# Altium project PCB_Project.PrjPcb
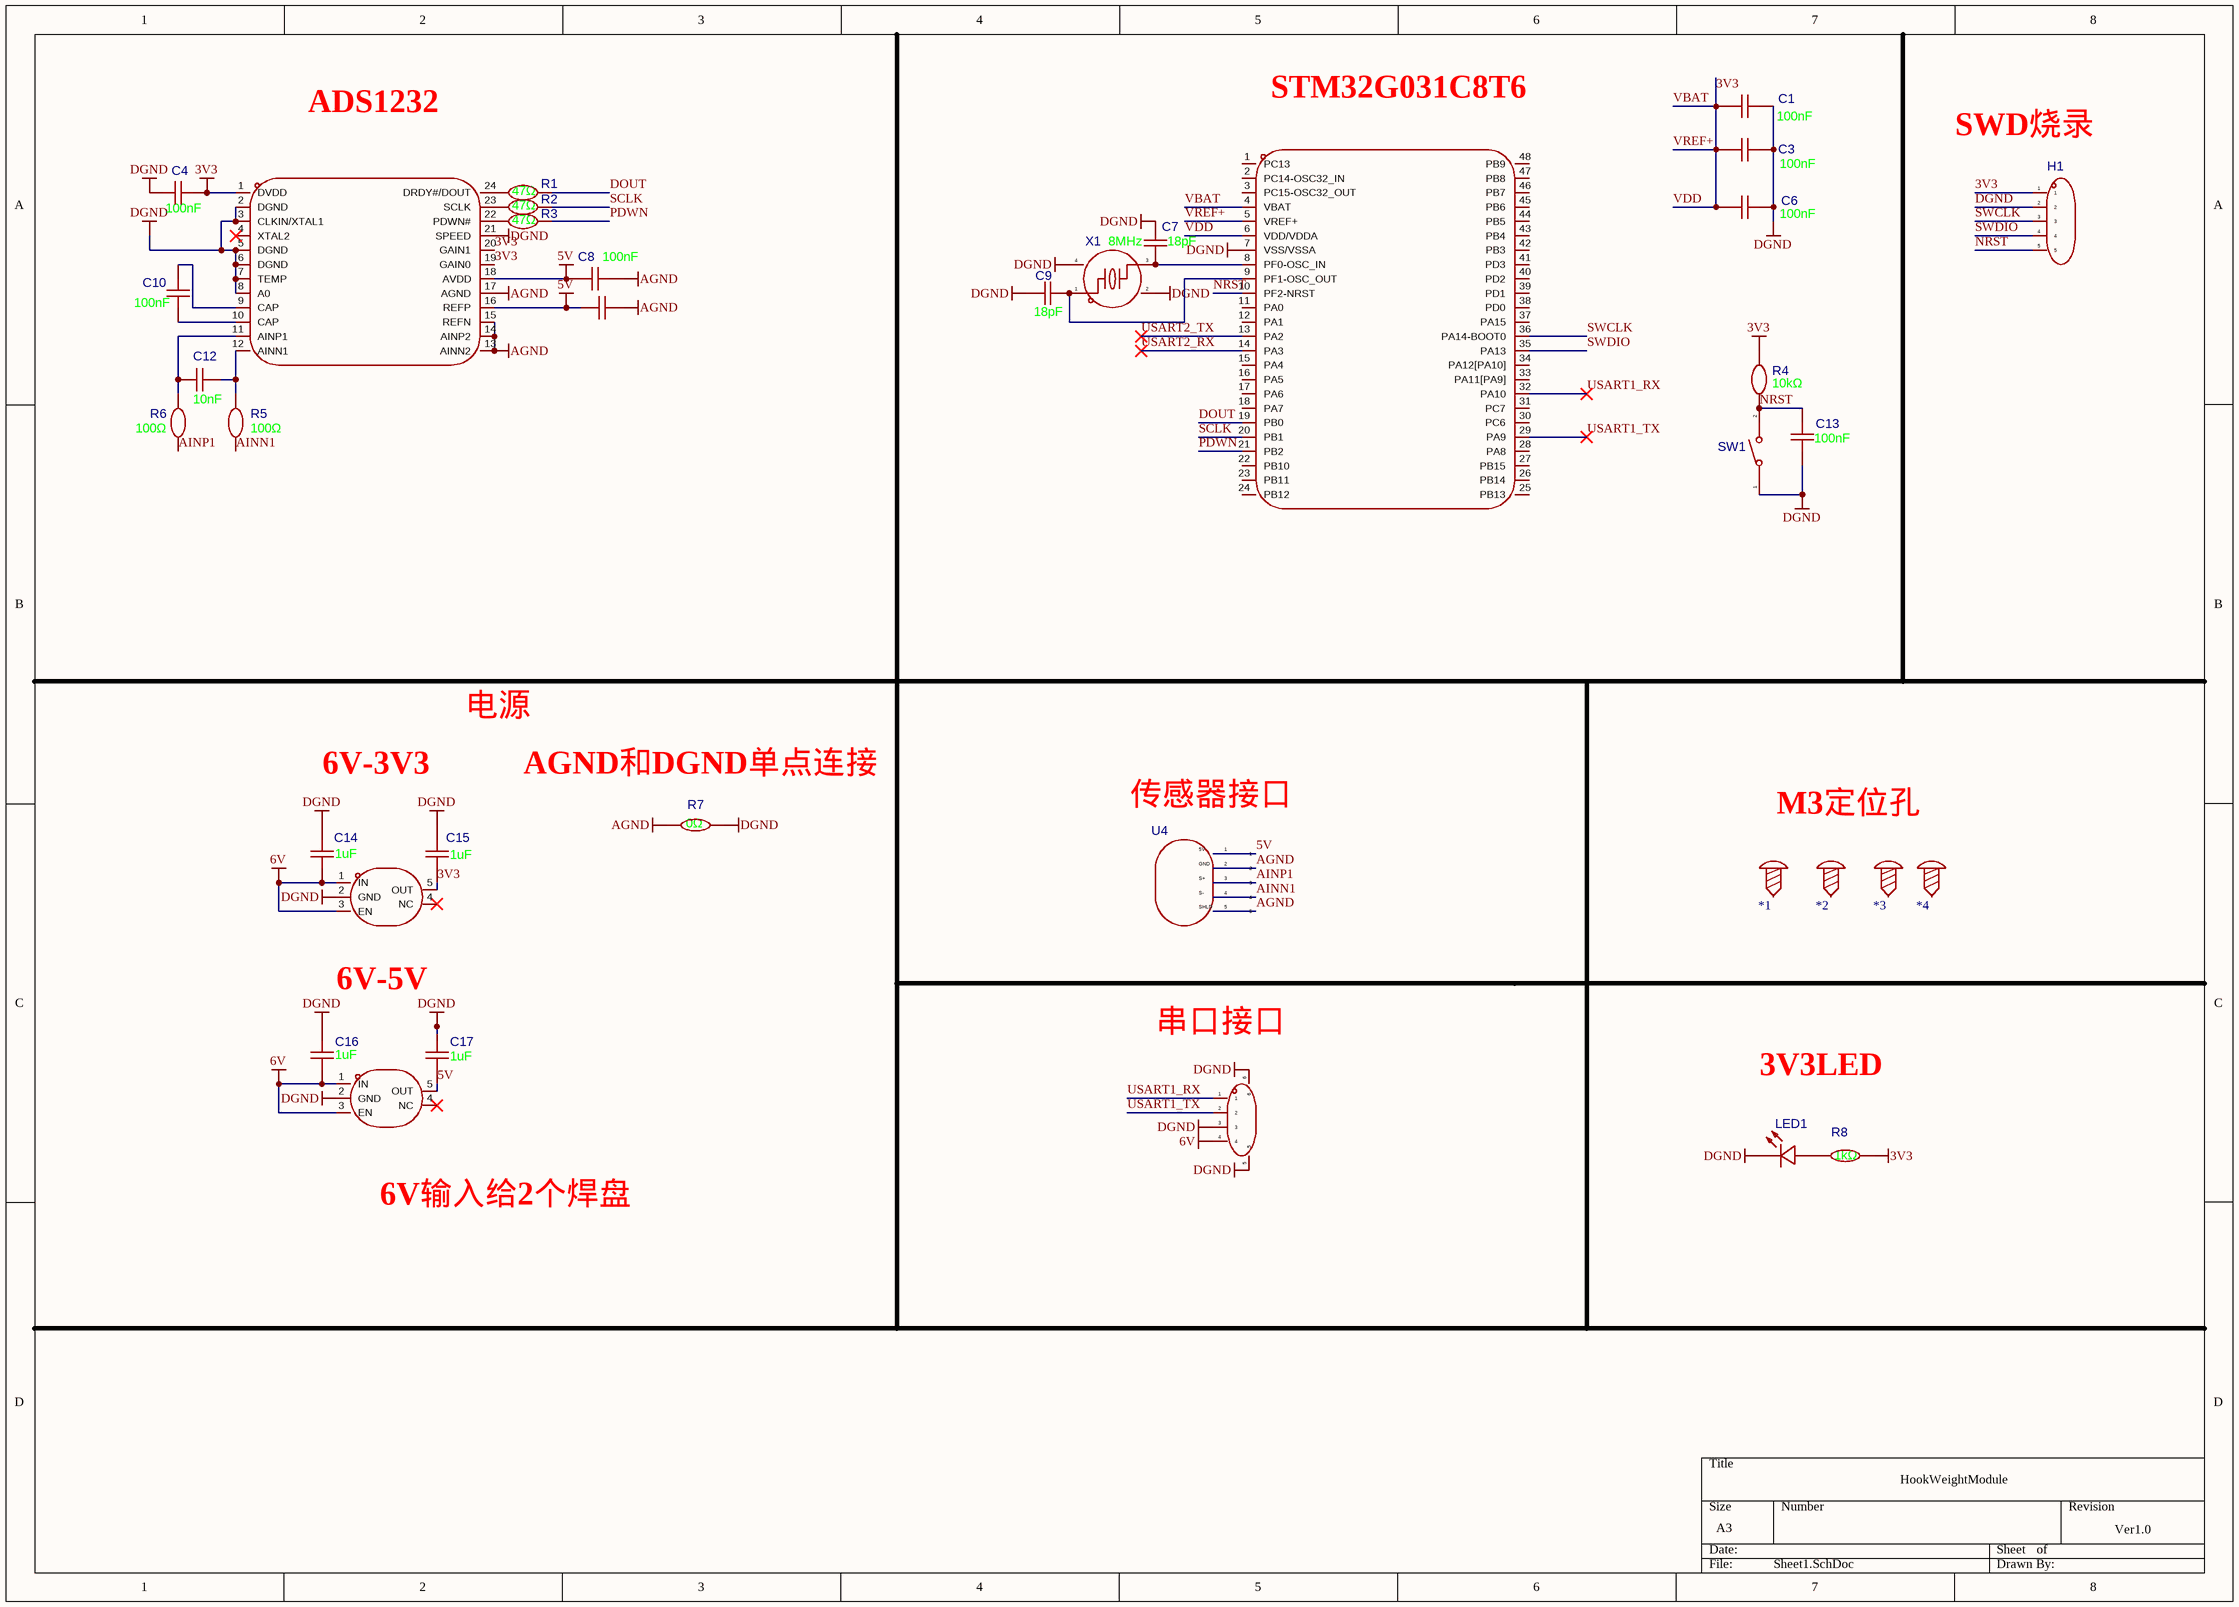
[diagram p0: Sheet1.SchDoc]
1 sheet, 37 parts. Net scope: global (net labels, ports and power ports of the same name join across sheets).
Board file: PCB1.PcbDoc

## Sheet Sheet1.SchDoc
size A3; SheetNumber: 1; SheetTotal: 1

### Parts
*1  螺丝孔_1  [M3螺丝]  (value not drawn)
*2  螺丝孔_1  [M3螺丝]  (value not drawn)
*3  螺丝孔_1  [M3螺丝]  (value not drawn)
*4  螺丝孔_1  [M3螺丝]  (value not drawn)
C1  value 100nF  [C0402]  (hidden comment: cc0402krx7r7bb104)
C3  value 100nF  [C0402]  (hidden comment: cc0402krx7r7bb104)
C4  value 100nF  [C0402]  (hidden comment: cc0402krx7r7bb104)
C6  value 100nF  [C0402]  (hidden comment: cc0402krx7r7bb104)
C7  value 18pF  [C0402]  (hidden comment: cc0402jrnpo9bn180)
C8  value 100nF  [C0402]  (hidden comment: cc0402krx7r7bb104)
C9  value 18pF  [C0402]  (hidden comment: cc0402jrnpo9bn180)
C10  value 100nF  [C0402]  (hidden comment: cc0402krx7r7bb104)
C11  cl21b103kbannnc  [C0805]  (value not drawn)
C12  value 10nF  [C0805]  (hidden comment: cl21b103kbannnc)
C13  value 100nF  [C0402]  (hidden comment: cc0402krx7r7bb104)
C14  value 1uF  [C0603]  (hidden comment: cga0603x5r105k500jt)
C15  value 1uF  [C0603]  (hidden comment: cga0603x5r105k500jt)
C16  value 1uF  [C0603]  (hidden comment: cga0603x5r105k500jt)
C17  value 1uF  [C0603]  (hidden comment: cga0603x5r105k500jt)
H1  pz254v-11-05p  [HDR-TH_5P-P2.54-V-M]  (value not drawn)
LED1  ltst-c190kskt  [LED0603-RD]  (value not drawn)
R1  value 47Ω  [R0402]  (hidden comment: frc0402f47r0ts)
R2  value 47Ω  [R0402]  (hidden comment: frc0402f47r0ts)
R3  value 47Ω  [R0402]  (hidden comment: frc0402f47r0ts)
R4  value 10kΩ  [R0603]  (hidden comment: frc0603f1002ts)
R5  value 100Ω  [R0603]  (hidden comment: frc0603f1000ts)
R6  value 100Ω  [R0603]  (hidden comment: frc0603f1000ts)
R7  value 0Ω  [R0603]  (hidden comment: 0603waf0000t5e)
R8  value 1kΩ  [R0603]  (hidden comment: 0603waf1001t5e)
SW1  ts-1088-ar02016  [SW-SMD_L3.9-W3.0-P4.45]  (value not drawn)
U2  ads1232ipwr  [TSSOP-24_L7.8-W4.4-P0.65-LS6.4-BL]  (value not drawn)
U3  stm32g031c8t6  [LQFP-48_L7.0-W7.0-P0.50-LS9.0-BL]  (value not drawn)
U4  5个焊盘  [5个焊盘 - duplicate]  (value not drawn)
U5  tps7a2033pdbvr  [SOT-23-5_L2.9-W1.6-P0.95-LS2.8-BR]  (value not drawn)
U6  tps7a2050pdbvr  [SOT-23-5_L2.9-W1.6-P0.95-LS2.8-BR]  (value not drawn)
U7  bx-xh2.54-4pwt  [CONN-SMD_4P-P2.50_BX-XH2.54-4PWT]  (value not drawn)
X1  value 8MHz  [CRYSTAL-SMD_4P-L3.2-W2.5-BL]  (hidden comment: x32258mob4si)

### Nets
3V3: C1.1 C3.1 C4.2 C6.1 C15.1 H1.1 R4.2 R8.2 U2.1(DVDD) U2.19(GAIN0) U2.20(GAIN1) U3.4(VBAT) U3.5(VREF+) U3.6(VDD/VDDA) U5.5(OUT)  [also labelled VBAT, VDD, VREF+]
5V: C8.1 C11.1 C17.1 U2.16(REFP) U2.18(AVDD) U4.1 U6.5(OUT)
6V: C14.1 C16.1 U5.1(IN) U5.3(EN) U6.1(IN) U6.3(EN) U7.4
AGND: C8.2 C11.2 R7.1 U2.13(AINN2) U2.14(AINP2) U2.15(REFN) U2.17(AGND) U4.2 U4.5
DGND: C1.2 C3.2 C4.1 C6.2 C7.2 C9.1 C13.1 C14.2 C15.2 C16.2 C17.2 H1.2 LED1.1(-) R7.2 SW1.1 U2.2(DGND) U2.3(CLKIN/XTAL1) U2.5(DGND) U2.6(DGND) U2.7(TEMP) U2.8(A0) U2.21(SPEED) U3.7(VSS/VSSA) U5.2(GND) U6.2(GND) U7.3 U7.5 U7.6 X1.2(GND) X1.4(GND)
AINN1: R5.1 U4.4
AINP1: R6.1 U4.3
DOUT: R1.2 U3.19(PB0)
NRST: C13.2 H1.5 R4.1 SW1.2 U3.10(PF2-NRST)
PDWN: R3.2 U3.21(PB2)
SCLK: R2.2 U3.20(PB1)
SWCLK: H1.3 U3.36(PA14-BOOT0)
SWDIO: H1.4 U3.35(PA13)
USART1_RX: U3.32(PA10) U7.1
USART1_TX: U3.29(PA9) U7.2
USART2_RX: U3.14(PA3)
USART2_TX: U3.13(PA2)
NetC7_1: C7.1 U3.8(PF0-OSC_IN) X1.3
NetC9_2: C9.2 U3.9(PF1-OSC_OUT) X1.1
NetC10_1: C10.1 U2.10(CAP)
NetC10_2: C10.2 U2.9(CAP)
NetC12_1: C12.1 R6.2 U2.11(AINP1)
NetC12_2: C12.2 R5.2 U2.12(AINN1)
NetLED1_2: LED1.2(+) R8.1
NetR1_1: R1.1 U2.24(DRDY#/DOUT)
NetR2_1: R2.1 U2.23(SCLK)
NetR3_1: R3.1 U2.22(PDWN#)

Not connected (* = marked no-connect by the designer): *1 1; *2 1; *3 1; *4 1; U2 4(XTAL2)*; U3 1(PC13) 2(PC14-OSC32_IN) 3(PC15-OSC32_OUT) 11(PA0) 12(PA1) 15(PA4) 16(PA5) 17(PA6) 18(PA7) 22(PB10) 23(PB11) 24(PB12) 25(PB13) 26(PB14) 27(PB15) 28(PA8) 30(PC6) 31(PC7) 33(PA11[PA9]) 34(PA12[PA10]) 37(PA15) 38(PD0) 39(PD1) 40(PD2) 41(PD3) 42(PB3) 43(PB4) 44(PB5) 45(PB6) 46(PB7) 47(PB8) 48(PB9); U5 4(NC)*; U6 4(NC)*

### Notes on the sheet
- ADS1232
- STM32G031C8T6
- (near H1) SWD烧录
- 电源
- 6V-3V3
- (near R7) AGND和DGND单点连接
- (near U4) 传感器接口
- M3定位孔
- 6V-5V
- (near U7) 串口接口
- 3V3LED
- 6V输入给2个焊盘
- HookWeightModule
- Ver1.0
- (in symbol 5个焊盘) 5V; GND; S+; S-; SHLD

### Library data of the parts
C1 C3 C4 C6 C8 C10 C13 = cc0402krx7r7bb104: 容值:100nF;精度:±10%;额定电压:16V;温度系数:X7R;; Manufacturer: YAGEO(国巨); AddInBom: yes; ModelId: 36a51122f27c49738f86b3bfa98863e0; ModelName: C0402_L1.0-W0.5-H0.5; ModelTransform: 39.37,19.685,0,0,0,0,0,0,0; Tolerance: ±10%; Voltage Rating: 16V; Temperature Coefficient: X7R; Symbol: CC0402KRX7R7BB104; LCSC Part Name: 100nF ±10% 16V; SupplierPart: C60474; ManufacturerPart: CC0402KRX7R7BB104; Supplier Footprint: 0402; JLCPCB Part Class: Extended Part; Datasheet: https://item.szlcsc.com/datasheet/CC0402KRX7R7BB104/61526.html; Supplier: LCSC; ConvertToPcb: yes; FootprintName: C0402
C7 C9 = cc0402jrnpo9bn180: 容值:18pF;精度:±5%;额定电压:50V;温度系数:NP0;; Manufacturer: YAGEO(国巨); AddInBom: yes; ModelId: 36a51122f27c49738f86b3bfa98863e0; ModelName: C0402_L1.0-W0.5-H0.5; ModelTransform: 39.37,19.685,0,0,0,0,0,0,0; Tolerance: ±5%; Voltage Rating: 50V; Temperature Coefficient: NP0; Symbol: CC0402JRNPO9BN180; LCSC Part Name: 18pF ±5% 50V; SupplierPart: C106202; ManufacturerPart: CC0402JRNPO9BN180; Supplier Footprint: 0402; JLCPCB Part Class: Extended Part; Datasheet: https://item.szlcsc.com/datasheet/CC0402JRNPO9BN180/107417.html; Supplier: LCSC; ConvertToPcb: yes; FootprintName: C0402
C11 = cl21b103kbannnc: 容值:10nF;精度:±10%;额定电压:50V;温度系数:X7R;; Manufacturer: SAMSUNG(三星); AddInBom: yes; ModelId: 1ba041120af144c991958decab20d241; ModelName: C0805_L2.0-W1.3-H1.3; ModelTransform: 78.74,51.181,0,0,0,0,0,0.0005,0; Value: 10nF; Tolerance: ±10%; Voltage Rating: 50V; Temperature Coefficient: X7R; Symbol: CL21B103KBANNNC; LCSC Part Name: 10nF ±10% 50V; SupplierPart: C1710; ManufacturerPart: CL21B103KBANNNC; Supplier Footprint: 0805; JLCPCB Part Class: Basic Part; Datasheet: https://item.szlcsc.com/datasheet/CL21B103KBANNNC/2062.html; Supplier: LCSC; ConvertToPcb: yes; FootprintName: C0805
C12 = cl21b103kbannnc: 容值:10nF;精度:±10%;额定电压:50V;温度系数:X7R;; Manufacturer: SAMSUNG(三星); AddInBom: yes; ModelId: 1ba041120af144c991958decab20d241; ModelName: C0805_L2.0-W1.3-H1.3; ModelTransform: 78.74,51.181,0,0,0,0,0,0.0005,0; Tolerance: ±10%; Voltage Rating: 50V; Temperature Coefficient: X7R; Symbol: CL21B103KBANNNC; LCSC Part Name: 10nF ±10% 50V; SupplierPart: C1710; ManufacturerPart: CL21B103KBANNNC; Supplier Footprint: 0805; JLCPCB Part Class: Basic Part; Datasheet: https://item.szlcsc.com/datasheet/CL21B103KBANNNC/2062.html; Supplier: LCSC; ConvertToPcb: yes; FootprintName: C0805
C14-C17 = cga0603x5r105k500jt: 容值:1uF;精度:±10%;额定电压:50V;温度系数:X5R;; Manufacturer: HRE(芯声); AddInBom: yes; ModelId: ac125912035d415993ca9572d50418b1; ModelName: C0603_L1.6-W0.8-H0.8; ModelTransform: 62.992,31.496,0,0,0,0,0,0,0; Tolerance: ±10%; Voltage Rating: 50V; Temperature Coefficient: X5R; Symbol: CGA0603X5R105K500JT; LCSC Part Name: 1uF ±10% 50V 停产; SupplierPart: C6119852; ManufacturerPart: CGA0603X5R105K500JT; Supplier Footprint: 0603; JLCPCB Part Class: Extended Part; Datasheet: https://item.szlcsc.com/datasheet/CGA0603X5R105K500JT/7062558.html; Supplier: LCSC; ConvertToPcb: yes; FootprintName: C0603
H1 = pz254v-11-05p: 插针结构:1x5P;间距:2.54mm;行距:-;圆针/方针:方针;安装方式:直插;排数:单排;总PIN位数:5P;额定电流:3A;额定电压:250V;配合针长度:6mm;塑高:2.5mm;端接针长度:3mm;触头材质:黄铜;触头镀层:-;工作温度:-40℃~+105℃;颜色:黑色;; Manufacturer: XFCN(兴飞); AddInBom: yes; ModelId: 47d466e4a34f4fc5bc626cf773a24dd5; ModelName: HDR-TH_5P-P2.54-M-LI-1X5P; ModelTransform: 499.999,100,0,0,0,0,0,0,-118.11; Pin Structure: 1x5P; Pitch: 2.54mm; Circluar Pins/Square Pins: 方针; Current Rating: 3A; Voltage Rating (Max): 250V; Symbol: PZ254V-11-05P; LCSC Part Name: 1x5P 间距:2.54mm 方针 直插; SupplierPart: C492404; ManufacturerPart: PZ254V-11-05P; Supplier Footprint: 插件,P=2.54mm; JLCPCB Part Class: Extended Part; Datasheet: https://item.szlcsc.com/datasheet/PZ254V-11-05P/502960.html; Supplier: LCSC; ConvertToPcb: yes; FootprintName: HDR-TH_5P-P2.54-V-M; Row Spacing: -; Mounting Type: 直插; Number of Rows: 单排; Number of Pins: 5P; Length of Mating Pin: 6mm; Insulation Height: 2.5mm; Length of End Connection Pin: 3mm; Contact Material: 黄铜; Contact Plating: -; Operating Temperature: -40℃~+105℃; Color: 黑色
LED1 = ltst-c190kskt: 灯头类型:-;发光颜色:黄色;正向压降(Vf):2.1V;功率:75mW;正向电流:20mA;波长:584.5nm~597nm;二极管配置:独立二极管;透镜颜色:无色透明透镜;色温:-;发光强度:104mcd;发光角度:130°;载带方式:-;工作温度:-30℃~+85℃;; Manufacturer: LITEON(光宝); AddInBom: yes; ModelId: 1f0d29a91be547639d425604e9b96ebb; ModelTransform: 63.7794,32.283,0,0,0,0,0,0,0; Illumination Color: 黄色; Voltage - Forward(Vf): 2.1V; Power(Watts): 75mW; Forward Current: 20mA; Peak Wavelength: 588nm; Diode Configuration: 独立二极管; Lens Color: 无色透明透镜; Luminous Intensity: 104mcd; Viewing Angle: 130°; Symbol: LTST-C190KSKT; LCSC Part Name: 黄灯; SupplierPart: C125095; ManufacturerPart: LTST-C190KSKT; Supplier Footprint: 0603; JLCPCB Part Class: Extended Part; Datasheet: https://item.szlcsc.com/datasheet/LTST-C190KSKT/136371.html; Supplier: LCSC; ConvertToPcb: yes; FootprintName: LED0603-RD; ModelName: LED0603-RD; Lamp Holder Type: -; Wavelength - Dominant: 584.5nm~597nm; Color Temperature: -; Mounting Style: -; Operating Temperature: -30℃~+85℃
R1-R3 = frc0402f47r0ts: 电阻类型:厚膜电阻;阻值:47Ω;精度:±1%;功率:62.5mW;工作电压:50V;温度系数:±100ppm/℃;; Manufacturer: FOJAN(富捷); AddInBom: yes; ModelId: 98c88bc2b9094f218f3a3e30a7012738; ModelName: R0402_L1.0-W0.5-H0.4; ModelTransform: 39.37,19.685,0,0,0,0,0,0,0; Tolerance: ±1%; Power(Watts): 62.5mW; Voltage-Supply(Max): 50V; Symbol: FRC0402F47R0TS; LCSC Part Name: 47Ω ±1% 62.5mW 厚膜电阻; SupplierPart: C2909362; ManufacturerPart: FRC0402F47R0TS; Supplier Footprint: 0402; JLCPCB Part Class: Extended Part; Datasheet: https://item.szlcsc.com/datasheet/FRC0402F47R0TS/3186297.html; Supplier: LCSC; ConvertToPcb: yes; FootprintName: R0402; Type: 厚膜电阻; Temperature Coefficient: ±100ppm/℃; Operating Temperature: -55℃~+155℃
R4 = frc0603f1002ts: 电阻类型:厚膜电阻;阻值:10kΩ;精度:±1%;功率:100mW;工作电压:75V;温度系数:±100ppm/℃;; Manufacturer: FOJAN(富捷); AddInBom: yes; ModelId: fc143cca1e79419f9cd78b61e9279f08; ModelTransform: 31.8897,63.7794,0,90,0,0,0,0,0; Tolerance: ±1%; Power(Watts): 100mW; Voltage-Supply(Max): 75V; Symbol: FRC0603F1002TS; LCSC Part Name: 10kΩ ±1% 100mW 厚膜电阻; SupplierPart: C2906982; ManufacturerPart: FRC0603F1002TS; Supplier Footprint: 0603; JLCPCB Part Class: Extended Part; Datasheet: https://item.szlcsc.com/datasheet/FRC0603F1002TS/3180495.html; Supplier: LCSC; ConvertToPcb: yes; FootprintName: R0603; ModelName: R0603; Type: 厚膜电阻; Temperature Coefficient: ±100ppm/℃; Operating Temperature: -55℃~+155℃
R5 R6 = frc0603f1000ts: 电阻类型:厚膜电阻;阻值:100Ω;精度:±1%;功率:100mW;工作电压:75V;温度系数:±100ppm/℃;; Manufacturer: FOJAN(富捷); AddInBom: yes; ModelId: fc143cca1e79419f9cd78b61e9279f08; ModelTransform: 31.8897,63.7794,0,90,0,0,0,0,0; Tolerance: ±1%; Power(Watts): 100mW; Voltage-Supply(Max): 75V; Symbol: FRC0603F1000TS; LCSC Part Name: 100Ω ±1% 100mW 厚膜电阻; SupplierPart: C2906981; ManufacturerPart: FRC0603F1000TS; Supplier Footprint: 0603; JLCPCB Part Class: Extended Part; Datasheet: https://item.szlcsc.com/datasheet/FRC0603F1000TS/3180494.html; Supplier: LCSC; ConvertToPcb: yes; FootprintName: R0603; ModelName: R0603; Type: 厚膜电阻; Temperature Coefficient: ±100ppm/℃; Operating Temperature: -55℃~+155℃
R7 = 0603waf0000t5e: 电阻类型:厚膜电阻;阻值:0Ω;精度:±1%;功率:100mW;工作电压:75V;温度系数:-;; Manufacturer: UNI-ROYAL(厚声); AddInBom: yes; ModelId: fc143cca1e79419f9cd78b61e9279f08; ModelTransform: 31.8897,63.7794,0,90,0,0,0,0,0; Tolerance: ±1%; Power(Watts): 100mW; Voltage-Supply(Max): 75V; Symbol: 0603WAF0000T5E; LCSC Part Name: 0Ω ±1% 100mW 厚膜电阻; SupplierPart: C21189; ManufacturerPart: 0603WAF0000T5E; Supplier Footprint: 0603; JLCPCB Part Class: Basic Part; Datasheet: https://item.szlcsc.com/datasheet/0603WAF0000T5E/21903.html; Supplier: LCSC; ConvertToPcb: yes; FootprintName: R0603; ModelName: R0603; Type: 厚膜电阻; Temperature Coefficient: -; Operating Temperature: -55℃~+155℃
R8 = 0603waf1001t5e: 电阻类型:厚膜电阻;阻值:1kΩ;精度:±1%;功率:100mW;工作电压:75V;温度系数:±100ppm/℃;; Manufacturer: UNI-ROYAL(厚声); AddInBom: yes; ModelId: fc143cca1e79419f9cd78b61e9279f08; ModelTransform: 31.8897,63.7794,0,90,0,0,0,0,0; Tolerance: ±1%; Power(Watts): 100mW; Voltage-Supply(Max): 75V; Symbol: 0603WAF1001T5E; LCSC Part Name: 1kΩ ±1% 100mW 厚膜电阻; SupplierPart: C21190; ManufacturerPart: 0603WAF1001T5E; Supplier Footprint: 0603; JLCPCB Part Class: Basic Part; Datasheet: https://item.szlcsc.com/datasheet/0603WAF1001T5E/21904.html; Supplier: LCSC; ConvertToPcb: yes; FootprintName: R0603; ModelName: R0603; Type: 厚膜电阻; Temperature Coefficient: ±100ppm/℃; Operating Temperature: -55℃~+155℃
SW1 = ts-1088-ar02016: 电路结构:单刀单掷;按钮形状:圆形按钮;作用力:1.6N;安装方式:立贴;开关长度:3.9mm;开关宽度:3mm;开关高度:2mm;带支架:不带支架;触点电流:50mA;额定电压:12V;带灯:-;工作寿命:10万次;; Manufacturer: XUNPU(讯普); AddInBom: yes; ModelId: b26698b69f274ffabef8a26c7d0e5dd1; ModelName: SW-SMD_L3.9-W2.9-H2.0-LS4.8; ModelTransform: 188.976,114.174,0,0,0,0,0,0,0; Circuit: 单刀单掷; Actuator Style: 圆形按钮; Operating Force: 1.6N; Switch Height: 2mm; with Bracket: 不带支架; Contact Current: 50mA; Voltage Rating: 12V; Actuator/Cap Color: 黑色; Life: 10万次; Symbol: TS-1088-AR02016; LCSC Part Name: 3.9*3*2mm 立贴 轻触开关; SupplierPart: C720477; ManufacturerPart: TS-1088-AR02016; Supplier Footprint: SMD,4x3mm; JLCPCB Part Class: Basic Part; Datasheet: https://item.szlcsc.com/datasheet/TS-1088-AR02016/763484.html; Supplier: LCSC; ConvertToPcb: yes; FootprintName: SW-SMD_L3.9-W3.0-P4.45; Mounting Type: 立贴; Length: 3.9mm; Width: 3mm; With Lamp: -; IP Rating: -; Termination Style: SMD接片; Operating Temperature: -30℃~+80℃
U2 = ads1232ipwr: 分辨率(位):24;采样率:10Hz;工作电压:2.7V~5.3V;接口类型:SPI;; Manufacturer: TI(德州仪器); AddInBom: yes; ModelId: 57e278220af748a2882c4abba4094eb9; ModelName: TSSOP-24_L7.8-W4.4-H1.0-LS6.4-P0.65; ModelTransform: 252.188,307.086,0,90,0,0,0,0,0; Resolution (Bits): 24; Sampling Rate: 10Hz; number of channels: 2; Interface: SPI; differential input: 是; Clock/Oscillator: 内置；外置; Clock Frequency: 4.9152MHz；200kHz~8MHz; Voltage Reference: 外置; Programmable Gain: 支持; Temperature Sensors: 内置; ADC architecture: Sigma-Delta; Data rate: 80Hz；10Hz; Quiescent Current (Iq): 1.3uA; Full-Scale Range(FSR): 39mV；1.25V；19.5mV；2.5V; Symbol: ADS1232IPW; LCSC Part Name: 用于桥式传感器的24bit 模数转换器; SupplierPart: C27919; ManufacturerPart: ADS1232IPWR; Supplier Footprint: TSSOP-24; JLCPCB Part Class: Extended Part; Datasheet: https://www.ti.com/cn/lit/gpn/ads1232; Supplier: LCSC; ConvertToPcb: yes; FootprintName: TSSOP-24_L7.8-W4.4-P0.65-LS6.4-BL; Voltage - Supply: 2.7V~5.3V; Integral non - linearity: -; Operating Temperature: -40℃~+105℃; Signal-to-Noise Ratio: -; Voltage Reference Drift: -
U3 = stm32g031c8t6: CPU内核:ARM Cortex-M0+;CPU最大主频:64MHz;CPU位数:32 Bit;; Manufacturer: ST(意法半导体); AddInBom: yes; ModelId: 093be70396ff421eb2cdb946d5311efc; ModelName: LQFP-48_L7.0-W7.0-H1.4-LS9.0-P0.50; ModelTransform: 354.331,354.331,0,0,0,0,0,0,0; CPU Maximum Speed: 64MHz; Core Size: 32 Bit; Program Storage Size: 64KB; Program Memory Type: FLASH; RAM Size: 8KB; Number of I/O: 44; ADC (Bit): 12bit; Oscillator Type: 内置+外置; Voltage - Supply: 1.7V~3.6V; Symbol: STM32G031C8T6; LCSC Part Name: 主流Arm Cortex-M0+ MCU，具有64 KB Flash存储器、8 KB RAM、64 MHz CPU、2x USART、定时器、ADC和通信接口，1.7-3.6V; SupplierPart: C432205; ManufacturerPart: STM32G031C8T6; Supplier Footprint: LQFP-48(7x7); JLCPCB Part Class: Extended Part; Datasheet: https://item.szlcsc.com/datasheet/STM32G031C8T6/428993.html; Supplier: LCSC; ConvertToPcb: yes; FootprintName: LQFP-48_L7.0-W7.0-P0.50-LS9.0-BL; CPU Core: ARM Cortex-M0+; EEPROM: -; Operating Temperature: -40℃~+85℃
U4 = 5个焊盘: Convert to PCB: yes; Device: 5个焊盘; Add into BOM: yes; Symbol: 5个焊盘
U5 = tps7a2033pdbvr: 输出类型:固定;最大输入电压:6V;输出电压:3.3V;输出电流:300mA;输出极性:正极;; Manufacturer: TI(德州仪器); AddInBom: yes; ModelId: 7ba65df16e7b4570af156e925f9c37fe; ModelTransform: 114.173,114.173,0,90,0,0,0,0,0; Output Type: 固定; Maximum Input Voltage: 6V; Output Voltage: 3.3V; Output Current: 300mA; Dropout Voltage: 140mV@(300mA); standby current: 15uA; Output Polarity: 正极; Number of Outputs: 1; Symbol: TPS7A2033PDBVR; LCSC Part Name: 具有高 PSRR 的 300mA、超低噪声、低 IQ、低压降 (LDO) 线性稳压器; SupplierPart: C2862740; ManufacturerPart: TPS7A2033PDBVR; Supplier Footprint: SOT-23-5; JLCPCB Part Class: Extended Part; Datasheet: https://www.ti.com/cn/lit/gpn/tps7a20; Supplier: LCSC; ConvertToPcb: yes; FootprintName: SOT-23-5_L2.9-W1.6-P0.95-LS2.8-BR; ModelName: SOT-23-5_L2.9-W1.6-P0.95-LS2.8-BR; Feature: 防静电保护；软启动；浪涌保护；低ESR；热保护(TSD)；欠压闭锁；过流保护(OCP)；带使能；防倒灌; Operating Temperature: -40℃~+125℃@(Tj)
U6 = tps7a2050pdbvr: 输出极性:正极;工作电压:6V;输出电压:5V;输出电流:300mA;电源纹波抑制比(PSRR):65dB@(100Hz);输出类型:固定;; Manufacturer: TI(德州仪器); AddInBom: yes; ModelId: 7ba65df16e7b4570af156e925f9c37fe; ModelTransform: 114.173,114.173,0,90,0,0,0,0,0; Output Configuration: 正极; Voltage - Supply: 6V; Output Voltage: 5V; Output Current: 300mA; Voltage Dropout: 140mV@(300mA); standby current: 6.5uA; Noise: 10uVrms; Output Type: 固定; Number of Outputs: 1; Symbol: TPS7A2050PDBVR; LCSC Part Name: 800mV~5.5V 300mA 6V; SupplierPart: C2864504; ManufacturerPart: TPS7A2050PDBVR; Supplier Footprint: SOT-23-5; JLCPCB Part Class: Extended Part; Datasheet: https://www.ti.com/cn/lit/ds/symlink/tps7a20.pdf; Supplier: LCSC; ConvertToPcb: yes; FootprintName: SOT-23-5_L2.9-W1.6-P0.95-LS2.8-BR; ModelName: SOT-23-5_L2.9-W1.6-P0.95-LS2.8-BR; Power Supply Rejection Ratio (PSRR): 65dB@(100Hz); Features: 使能控制；输入欠压保护；内置软启动；短路保护；过流保护；输出放电；热关断; Operating Temperature: -40℃~+125℃@(Tj)
U7 = bx-xh2.54-4pwt: 插针结构:1x4P;间距:2.5mm;安装方式:卧贴;参考系列:XH;总PIN数:4P;排数:1;每排PIN数:4;行距:-;额定电流:3A;触头材质:黄铜;触头镀层:锡;工作温度:-25℃~+85℃;; Manufacturer: Bossie(博锡); AddInBom: yes; ModelId: fc4292fdbd0c45d68488b12ac9a84ffb; ModelTransform: 590.55,413.385,0,0,0,0,-0.003,-11.339,0; Pins Structure: 1x4P; Pitch: 2.5mm; Reference Series: XH; Number of PINs Per Row: 4; Current Rating: 3A; Voltage Rating: 250V; Supplementary Features: 辅助焊脚; Z-Height of the Board: 6.2mm; X-Length of Bottom Edge on Board (Spacing Line): 15mm; Y-Width of Bottom Edge on Board: 10.5mm; Symbol: BX-XH2.54-4PWT; LCSC Part Name: 1x4P 间距:2.5mm 卧贴 系列:XH; SupplierPart: C18077874; ManufacturerPart: BX-XH2.54-4PWT; Supplier Footprint: SMD,P=2.54mm,卧贴; JLCPCB Part Class: Extended Part; Datasheet: https://item.szlcsc.com/datasheet/BX-XH2.54-4PWT/19218275.html; Supplier: LCSC; ConvertToPcb: yes; FootprintName: CONN-SMD_4P-P2.50_BX-XH2.54-4PWT; ModelName: CONN-SMD_4P-P2.50_BX-XH2.54-4PWT; Mounting Type: 卧贴; Number of Pins: 4P; Number of Rows: 1; Row Spacing: -; Contact Material: 黄铜; Contact Plating: 锡; Operating Temperature: -25℃~+85℃; Plastic Material: -; Flame Retardant Rating: -; Color: 米色
X1 = x32258mob4si: 晶振类型:贴片晶振;频率:8MHz;常温频差:±10ppm;负载电容:12pF;频率稳定度:±20ppm;; Manufacturer: YXC(扬兴晶振); AddInBom: yes; ModelId: ff2dfd5650294453a14147960efe1838; ModelTransform: 125.984,98.425,0,0,0,0,0,0,0; Normal temperature Frequency Tolerance: ±10ppm; Load Capacitance: 12pF; Frequency Stability: ±20ppm; Equivalent Series Resistance(ESR): 180Ω; Symbol: X32258MOB4SI; LCSC Part Name: YSX321SL 8MHZ 4P 3225 12PF ±10PPM -40~85℃ (±20PPM); SupplierPart: C2682775; ManufacturerPart: X32258MOB4SI; Supplier Footprint: SMD3225-4P; JLCPCB Part Class: Extended Part; Datasheet: https://item.szlcsc.com/datasheet/X32258MOB4SI/2777872.html; Supplier: LCSC; ConvertToPcb: yes; FootprintName: CRYSTAL-SMD_4P-L3.2-W2.5-BL; ModelName: CRYSTAL-SMD_4P-L3.2-W2.5-BL; Type: 贴片晶振; Operating Temperature: -40℃~+85℃